# EAGLE schematic BrainA2-B-11Nov2016 (EAGLE 7.5.0)
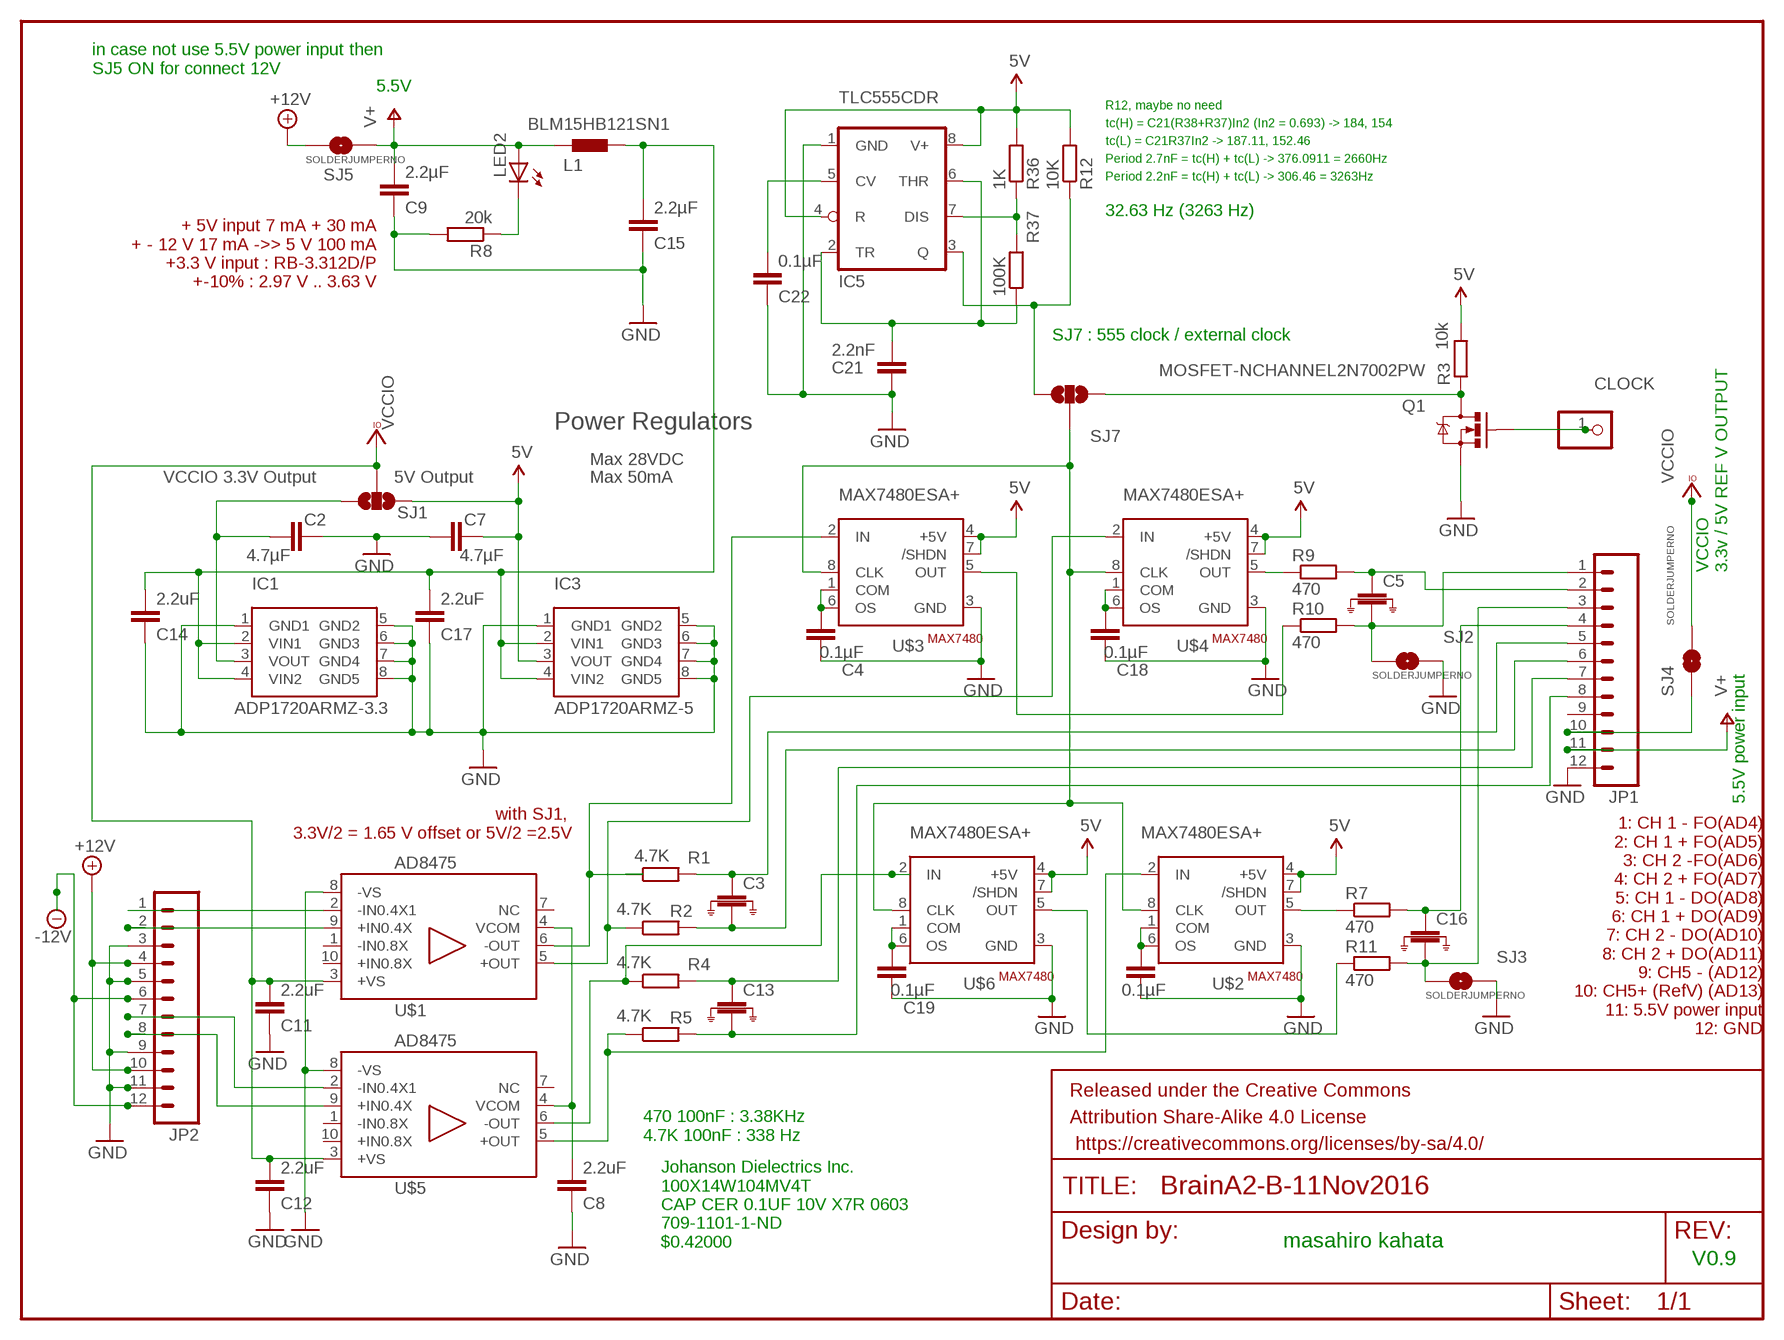
[diagram p0: schematic, sheet 1]

## Parts
C1  0.1µF  CAP0402-CAP  [0402-CAP]
C2  4.7µF  CAP0402-CAP  [0402-CAP]
C3  C-EUX2Y  [C0603]
C4  0.1µF  CAP0402-CAP  [0402-CAP]
C5  C-EUX2Y  [C0603]
C7  4.7µF  CAP0402-CAP  [0402-CAP]
C8  2.2uF  C-EUC0402  [C0402]
C9  2.2µF  CAP0402-CAP  [0402-CAP]
C11  2.2uF  C-EUC0402  [C0402]
C12  2.2uF  C-EUC0402  [C0402]
C13  C-EUX2Y  [C0603]
C14  2.2uF  C-EUC0402  [C0402]
C15  2.2µF  CAP0402-CAP  [0402-CAP]
C16  C-EUX2Y  [C0603]
C17  2.2uF  C-EUC0402  [C0402]
C18  0.1µF  CAP0402-CAP  [0402-CAP]
C19  0.1µF  CAP0402-CAP  [0402-CAP]
C21  2.2nF  C-EUC0402  [C0402]
C22  0.1µF  C-EUC0402  [C0402]
CLOCK  PINHD-1X1  [1X01]
FRAME1  FRAME-LETTER  [CREATIVE_COMMONS]
IC1  ADP1720ARMZ-3.3  POWER  [MSOP08]
IC3  ADP1720ARMZ-5  POWER  [MSOP08]
IC5  TLC555CDR  LM555D  [SO08]
JP1  M12NO_SILK  [1X12_NO_SILK]
JP2  M12NO_SILK  [1X12_NO_SILK]
L1  BLM15HB121SN1  [0402]
LED2  LEDCHIP-LED0603  [CHIP-LED0603]
Q1  MOSFET-NCHANNEL2N7002PW  [SOT323]
R1  4.7K  R-EU_R0402  [R0402]
R2  4.7K  R-EU_R0402  [R0402]
R3  10k  R-EU_R0402  [R0402]
R4  4.7K  R-EU_R0402  [R0402]
R5  4.7K  R-EU_R0402  [R0402]
R7  470  R-EU_R0402  [R0402]
R8  20k  R-EU_R0402  [R0402]
R9  470  R-EU_R0402  [R0402]
R10  470  R-EU_R0402  [R0402]
R11  470  R-EU_R0402  [R0402]
R12  10K  R-EU_R0402  [R0402]
R36  1K  R-EU_R0402  [R0402]
R37  100K  R-EU_R0402  [R0402]
SJ1  SOLDERJUMPER_2WAYS  [SJ_3]
SJ2  SOLDERJUMPERNO  [SJ_2S-NO]
SJ3  SOLDERJUMPERNO  [SJ_2S-NO]
SJ4  SOLDERJUMPERNO  [SJ_2S-NO]
SJ5  SOLDERJUMPERNO  [SJ_2S-NO]
SJ7  SOLDERJUMPER_2WAYS  [SJ_3]
U$1  AD8475  [MSOP10]
U$2  MAX7480ESA+  MAX7480  [MAX7480]
U$3  MAX7480ESA+  MAX7480  [MAX7480]
U$4  MAX7480ESA+  MAX7480  [MAX7480]
U$5  AD8475  [MSOP10]
U$6  MAX7480ESA+  MAX7480  [MAX7480]

## Nets
5V: C7.1 IC3.3(VOUT) IC5.4(R) IC5.8(V+) R3.2 R12.2 R36.2 SJ1.1 U$2.4(+5V) U$2.7(/SHDN) U$3.4(+5V) U$3.7(/SHDN) U$4.4(+5V) U$4.7(/SHDN) U$6.4(+5V) U$6.7(/SHDN)
+12V: JP2.4 JP2.10 SJ5.1
-12V: JP2.6 JP2.12
GND: C1.1 C2.1 C4.1 C7.2 C8.1 C9.1 C11.1 C12.1 C14.1 C15.1 C17.1 C18.1 C19.1 C21.1 C22.1 IC1.1(GND1) IC1.5(GND2) IC1.6(GND3) IC1.7(GND4) IC1.8(GND5) IC3.1(GND1) IC3.5(GND2) IC3.6(GND3) IC3.7(GND4) IC3.8(GND5) IC5.1(GND) JP1.12 JP2.3 JP2.5 JP2.9 JP2.11 Q1.2(S) R8.2 SJ2.2 SJ3.2 U$1.8(-VS) U$2.3(GND) U$3.3(GND) U$4.3(GND) U$5.8(-VS) U$6.3(GND)
N$2: C13.2 JP1.8 R5.2
N$6: C1.2 U$2.1(COM) U$2.6(OS)
N$10: R11.1 U$6.5(OUT)
N$11: JP2.1 U$1.2(-IN0.4X1)
N$13: R7.1 U$2.5(OUT)
N$14: JP2.2 U$1.9(+IN0.4X)
N$15: C3.2 JP1.6 R2.2
N$16: C3.1 JP1.5 R1.2
N$18: C5.2 JP1.1 R10.2 SJ2.1
N$19: R2.1 U$1.5(+OUT) U$4.2(IN)
N$21: C4.2 U$3.1(COM) U$3.6(OS)
N$22: Q1.3(D) R3.1 SJ7.3
N$25: JP1.10 SJ4.1
N$26: R10.1 U$3.5(OUT)
N$28: C8.2 U$1.4(VCOM) U$5.4(VCOM)
N$29: LED2.C R8.1
N$30: R4.1 U$5.6(-OUT) U$6.2(IN)
N$31: JP2.8 U$5.9(+IN0.4X)
N$33: C13.1 JP1.7 R4.2
N$35: JP2.7 U$5.2(-IN0.4X1)
N$38: C5.1 JP1.2 R9.2
N$39: C18.2 U$4.1(COM) U$4.6(OS)
N$43: C14.2 C15.2 C17.2 IC1.2(VIN1) IC1.4(VIN2) IC3.2(VIN1) IC3.4(VIN2) L1.2
N$46: R9.1 U$4.5(OUT)
N$50: CLOCK.1 Q1.1(G)
N$53: R5.1 U$2.2(IN) U$5.5(+OUT)
N$55: R1.1 U$1.6(-OUT) U$3.2(IN)
N$58: IC5.3(Q) R12.1 SJ7.1
N$61: C16.1 JP1.4 R7.2
N$63: C2.2 IC1.3(VOUT) SJ1.3
N$65: C16.2 JP1.3 R11.2 SJ3.1
N$67: C19.2 U$6.1(COM) U$6.6(OS)
N$69: SJ7.2 U$2.8(CLK) U$3.8(CLK) U$4.8(CLK) U$6.8(CLK)
N$78: IC5.7(DIS) R36.1 R37.2
N$80: C21.2 IC5.2(TR) IC5.6(THR) R37.1
N$83: C22.2 IC5.5(CV)
V+: C9.2 JP1.11 L1.1 LED2.A SJ5.2
VCCIO: C11.2 C12.2 SJ1.2 SJ4.2 U$1.3(+VS) U$5.3(+VS)
Unconnected: JP1.9 U$1.1(-IN0.8X) U$1.7(NC) U$1.10(+IN0.8X) U$5.1(-IN0.8X) U$5.7(NC) U$5.10(+IN0.8X)

## Notes on the sheet
- in case not use 5.5V power input then
  SJ5 ON for connect 12V
- 5.5V
- R12, maybe no need
- tc(H) = C21(R38+R37)In2 (In2 = 0.693) -> 184, 154
- tc(L) = C21R37In2 -> 187.11, 152.46
- Period 2.7nF = tc(H) + tc(L) -> 376.0911 = 2660Hz
- Period 2.2nF = tc(H) + tc(L) -> 306.46 = 3263Hz
- 32.63 Hz (3263 Hz)
- + 5V input 7 mA + 30 mA
  + - 12 V 17 mA ->> 5 V 100 mA
  +3.3 V input : RB-3.312D/P
  +-10% : 2.97 V .. 3.63 V
- SJ7 : 555 clock / external clock
- Power Regulators
- Max 28VDC
- VCCIO 3.3V Output | 5V Output | Max 50mA
- VCCIO
  3.3v / 5V REF V OUTPUT
- 5.5V power input
- with SJ1, 
  3.3V/2 = 1.65 V offset or 5V/2 =2.5V
- 1: CH 1 - FO(AD4)
  2: CH 1 + FO(AD5)
  3: CH 2 -FO(AD6)
  4: CH 2 + FO(AD7)
  5: CH 1 - DO(AD8)
  6: CH 1 + DO(AD9)
  7: CH 2 - DO(AD10)
  8: CH 2 + DO(AD11)
  9: CH5 - (AD12)
  10: CH5+ (RefV) (AD13)
  11: 5.5V power input
  12: GND
- 470 100nF : 3.38KHz
  4.7K 100nF : 338 Hz
- Johanson Dielectrics Inc. 
  100X14W104MV4T 
  CAP CER 0.1UF 10V X7R 0603 
  709-1101-1-ND 
  $0.42000
- masahiro kahata
- V0.9

## Power pins joined to a net without a drawn wire
GND: C3.GND C5.GND C13.GND C16.GND

## Library data of the parts
C1 C2 C4 C7 C9 C15 C18 C19 = SparkFun-Capacitors:CAP: Capacitor Standard 0603 ceramic capacitor, and 0.1" leaded capacitor.
C3 C5 C13 C16 = AD7173:C-EU: CAPACITOR, European symbol
C8 C11 C12 C14 C17 C21 C22 = rcl:C-EU: CAPACITOR, European symbol
CLOCK = pinhead:PINHD-1X1: PIN HEADER
FRAME1 = SparkFun-Aesthetics:FRAME-LETTER: Schematic Frame Standard 8.5x11 US Letter frame
IC1 IC3 = AD7173:POWER
IC5 = linear:*555: TIMER
JP1 JP2 = SparkFun-Connectors:M12: Header 12 Standard 12-pin 0.1" header. Use with straight break away headers (SKU : PRT-00116), right angle break away headers (PRT-00553), swiss pins (PRT-00743), machine pins (PRT-00117), and female headers (PRT-00115).
L1 = inductors:BLM15H: EMIFIL (R) Chip Ferrite Bead for GHz Noise Source: http://www.murata.com/ Ferrite Bead BLM15H.pdf
LED2 = led:LED: LED OSRAM: - CHIPLED LG R971, LG N971, LY N971, LG Q971, LY Q971, LO R971, LY R971 LH N974, LH R974 LS Q976, LO Q976, LY Q976 LO Q996 - Hyper CHIPLED LW Q18S LB Q993, LB Q99A, LB R99A - SideLED LS A670, LO A670, LY A670, LG A670, LP A670 LB A673, LV A673, LT A673, LW A673 LH A674 LY A675 LS A676, LA A676, LO A676, LY A676, LW A676 LS A679, LY A679, LG A679 - Hyper Micro SIDELED® LS Y876, LA Y876, LO Y876, LY Y876 LT Y87S - SmartLED LW L88C, LW L88S LB L89C, LB L89S, LG L890 LS L89K, LO L89K, LY L89K LS L896, LA L896, LO L896, LY L896 - TOPLED LS T670, LO T670, LY T670, LG T670, LP T670 LSG T670, LSP T670, LSY T670, LOP T670, LYG T670 LG T671, LOG T671, LSG T671 LB T673, LV T673, LT T673, LW T673 LH T674 LS T676, LA T676, LO T676, LY T676, LB T676, LH T676, LSB T676, LW T676 LB T67C, LV T67C, LT T67C, LS T67K, LO T67K, LY T67K, LW E67C LS E67B, LA E67B, LO E67B, LY E67B, LB E67C, LV E67C, LT E67C LW T67C LS T679, LY T679, LG T679 LS T770, LO T770, LY T770, LG T770, LP T770 LB T773, LV T773, LT T773, LW T773 LH T774 LS E675, LA E675, LY E675, LS T675 LS T776, LA T776, LO T776, LY T776, LB T776 LHGB T686 LT T68C, LB T68C - Hyper Mini TOPLED® LB M676 - Mini TOPLED Santana® LG M470 LS M47K, LO M47K, LY M47K Source: http://www.osram.convergy.de LUXEON: - LUMILED® LXK2-PW12-R00, LXK2-PW12-S00, LXK2-PW14-U00, LXK2-PW14-V00 LXK2-PM12-R00, LXK2-PM12-S00, LXK2-PM14-U00 LXK2-PE12-Q00, LXK2-PE12-R00, LXK2-PE12-S00, LXK2-PE14-T00, LXK2-PE14-U00 LXK2-PB12-K00, LXK2-PB12-L00, LXK2-PB12-M00, LXK2-PB14-N00, LXK2-PB14-P00, LXK2-PB14-Q00 LXK2-PR12-L00, LXK2-PR12-M00, LXK2-PR14-Q00, LXK2-PR14-R00 LXK2-PD12-Q00, LXK2-PD12-R00, LXK2-PD12-S00 LXK2-PH12-R00, LXK2-PH12-S00 LXK2-PL12-P00, LXK2-PL12-Q00, LXK2-PL12-R00 Source: www.luxeon.com KINGBRIGHT: KA-3528ASYC Source: www.kingbright.com
Q1 = SparkFun-DiscreteSemi:MOSFET-NCHANNEL: Common NMOSFET Parts MFG P/N Store ID Prod ID FDD8780 TRANS-09984 SI7820DN TRANS-11055 FDS6630A IC-08089 2N7002PW TRANS-11151 FQP30N06L COM-10213 TRANS-10060 BSS123LT1G TRANS-08345 BSS138 TRANS-00830 BS170 2N7000; PROD_ID: TRANS-11151
R1-R5 R7-R12 R36 R37 = rcl:R-EU_: RESISTOR, European symbol
SJ1 SJ7 = SparkFun-Retired:SOLDERJUMPER_2WAY: Solder Jumper 2 way solder jumper
SJ2-SJ5 = SparkFun-Retired:SOLDERJUMPER: Solder Jumper Standard SMD solder jumper. Used to automate production. Two varients : Normally Open and Normally Closed are the same, but have different paste layers. NC will have a large amount of paste and should jumper during reflow.
U$1 U$5 = MKH:AD8475: Precision, Selectable Gain, Fully Differential Funnel Amplifier
U$2-U$4 U$6 = MKH:MAX7480: Switched-Capacitor Filter

## Net classes
0 default: clearance 0.205 mm